# EAGLE design Geiger (EAGLE 5.11)
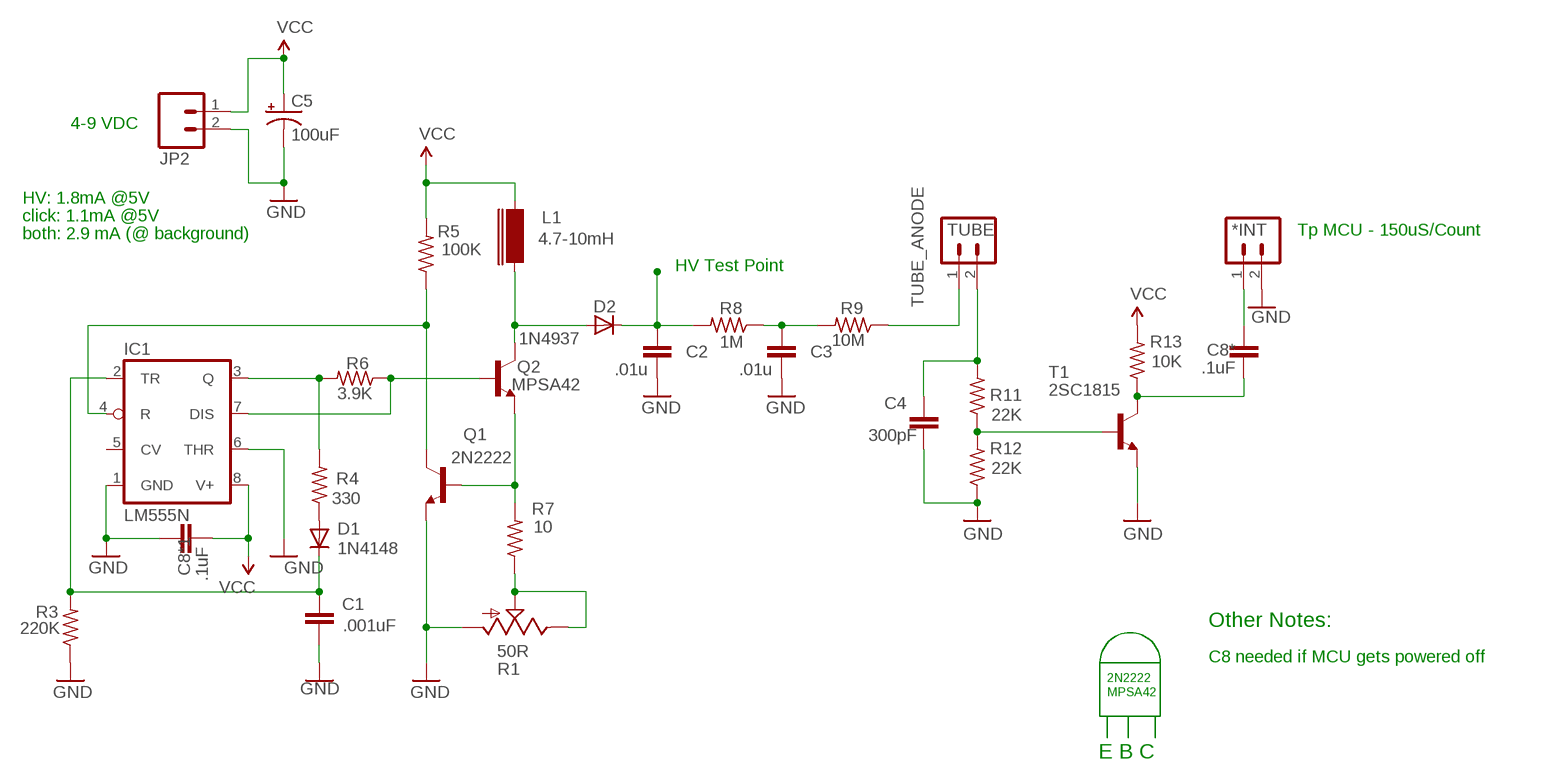
[diagram p0: schematic, sheet 1]

## Parts
*INT  M02PTH  [1X02]
C1  .001uF  CAPPTH  [CAP-PTH-SMALL]
C2  .01u  C-EU050-025X075  [C050-025X075]
C3  .01u  C-EU050-025X075  [C050-025X075]
C4  300pF  CAPPTH  [CAP-PTH-SMALL]
C5  100uF  CAP_POLPTH1  [CPOL-RADIAL-100UF-25V]
C8*  .1uF  CAPPTH  [CAP-PTH-SMALL]
C8*1  .1uF  CAPPTH  [CAP-PTH-SMALL]
D1  1N4148  1N4148DO35-7  [DO35-7]
D2  1N4937  1N4933  [DO41-10]
IC1  LM555N  [DIL08]
JP2  M02SCREW  [SCREWTERMINAL-3.5MM-2]
L1  4.7-10mH  INDUCTOR_4.7MH-1000  [.32IN_RADIAL]
Q1  2N2222  TRANSISTOR_NPNTO92  [TO-92]
Q2  MPSA42  TRANSISTOR_NPNTO92  [TO-92]
R1  50R  TRIM_US-B25P  [B25P]
R3  220K  R-US_0204/5  [0204/5]
R4  330  R-US_0204/5  [0204/5]
R5  100K  R-US_0204/5  [0204/5]
R6  3.9K  R-US_0204/5  [0204/5]
R7  10  R-US_0204/5  [0204/5]
R8  1M  R-US_0204/5  [0204/5]
R9  10M  R-US_0204/5  [0204/5]
R11  22K  R-US_0204/5  [0204/5]
R12  22K  R-US_0204/5  [0204/5]
R13  10K  R-US_0204/5  [0204/5]
T1  2SC1815  [TO92-ECB]
TUBE  M02PTH  [1X02]

## Nets
GND: *INT.2 C1.1 C2.2 C3.2 C4.1 C5.2(-) C8*1.1 IC1.1(GND) IC1.6(THR) JP2.2 Q1.1(E) R1.A R3.1 R12.1 T1.E
N$1: IC1.3(Q) R4.2 R6.2
N$2: C2.1 D2.C R8.2
N$3: R1.E R1.S R7.1
N$4: C1.2 D1.C IC1.2(TR) R3.2
N$5: C4.2 R11.2 TUBE.2
N$6: C3.1 R8.1 R9.2
N$8: R11.1 R12.2 T1.B
N$10: IC1.7(DIS) Q2.2(B) R6.1
N$12: IC1.4(R) Q1.3(C) R5.1
N$13: D1.A R4.1
N$14: C8*.2 R13.1 T1.C
N$15: Q1.2(B) Q2.1(E) R7.2
N$16: *INT.1 C8*.1
N$17: D2.A L1.2 Q2.3(C)
TUBE_ANODE: R9.1 TUBE.1
VCC: C5.1(+) C8*1.2 IC1.8(V+) JP2.1 L1.1 R5.2 R13.2
Unconnected: IC1.5(CV)

## Notes on the sheet
- 4-9 VDC
- HV: 1.8mA @5V
- click: 1.1mA @5V
- both: 2.9 mA (@ background) | Tp MCU - 150uS/Count
- HV Test Point
- Other Notes:
- C8 needed if MCU gets powered off
- 2N2222
- MPSA42
- E B C

## Library data of the parts
*INT JP2 TUBE = _JJG-parts:M02: Header 2 Standard 2-pin 0.1" header. Use with straight break away headers (SKU : PRT-00116), right angle break away headers (PRT-00553), swiss pins (PRT-00743), machine pins (PRT-00117), and female headers (PRT-00115). Molex polarized connector foot print use with SKU : PRT-08233 with associated crimp pins and housings.
C1 C4 C8* C8*1 = SparkFun:CAP: Capacitor Standard 0603 ceramic capacitor, and 0.1" leaded capacitor.
C2 C3 = resistor:C-EU: CAPACITOR, European symbol
C5 = SparkFun:CAP_POL: Capacitor Polarized These are standard SMD and PTH capacitors. Normally 10uF, 47uF, and 100uF in electrolytic and tantalum varieties. Always verify the external diameter of the through hole cap, it varies with capacity, voltage, and manufacturer. The EIA devices should be standard.
D1 = diode:1N4148: DIODE high speed (Philips)
D2 = diode:1N4933: DIODE fast recovery rectifier, 1A
IC1 = linear:*555: TIMER
L1 = _JJG-parts:INDUCTOR_4.7MH: INDUCTOR - .47 mH Goldmine #G16604
Q1 Q2 = SparkFun:TRANSISTOR_NPN: Transistor NPN BJT configuration in SOT23 package. MMBT2222 is the common NPN we use. Double check BCE configuration again layout.
R1 = pot:TRIM_US-: POTENTIOMETER
R3-R9 R11-R13 = rcl:R-US_: RESISTOR, American symbol
T1 = transistor:2SC1815: NPN EPITAXIAL TRANSISTOR Source: TOSHIBA .. 2SC1815 1.pdf

## Board
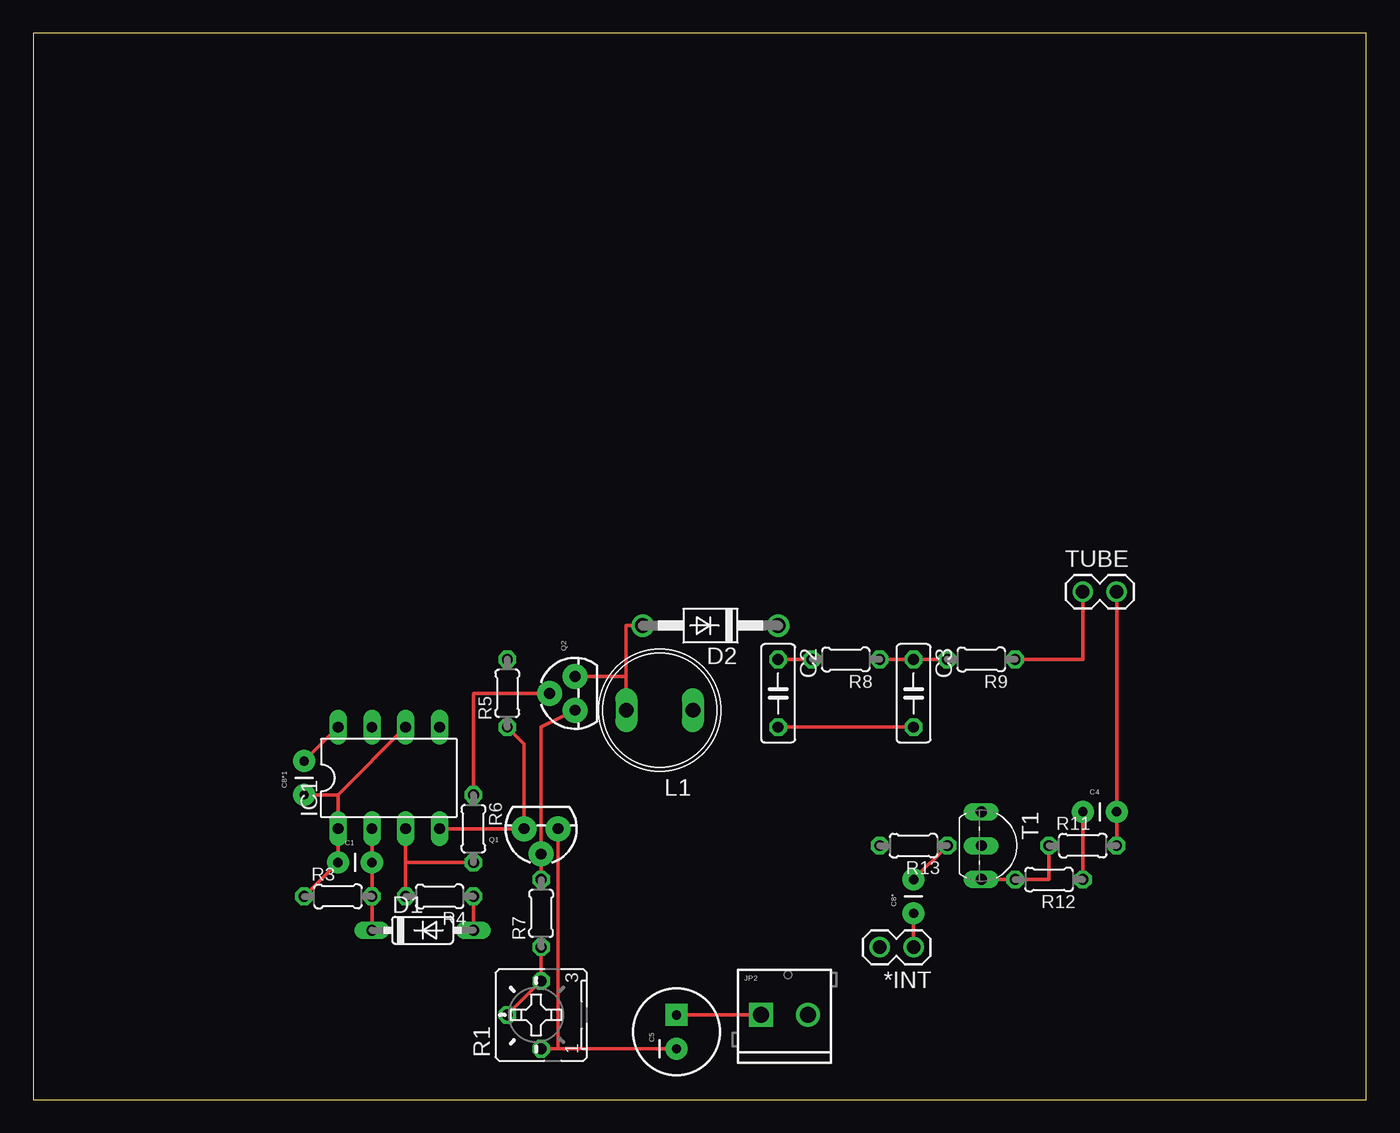
[diagram p1: board, top side]
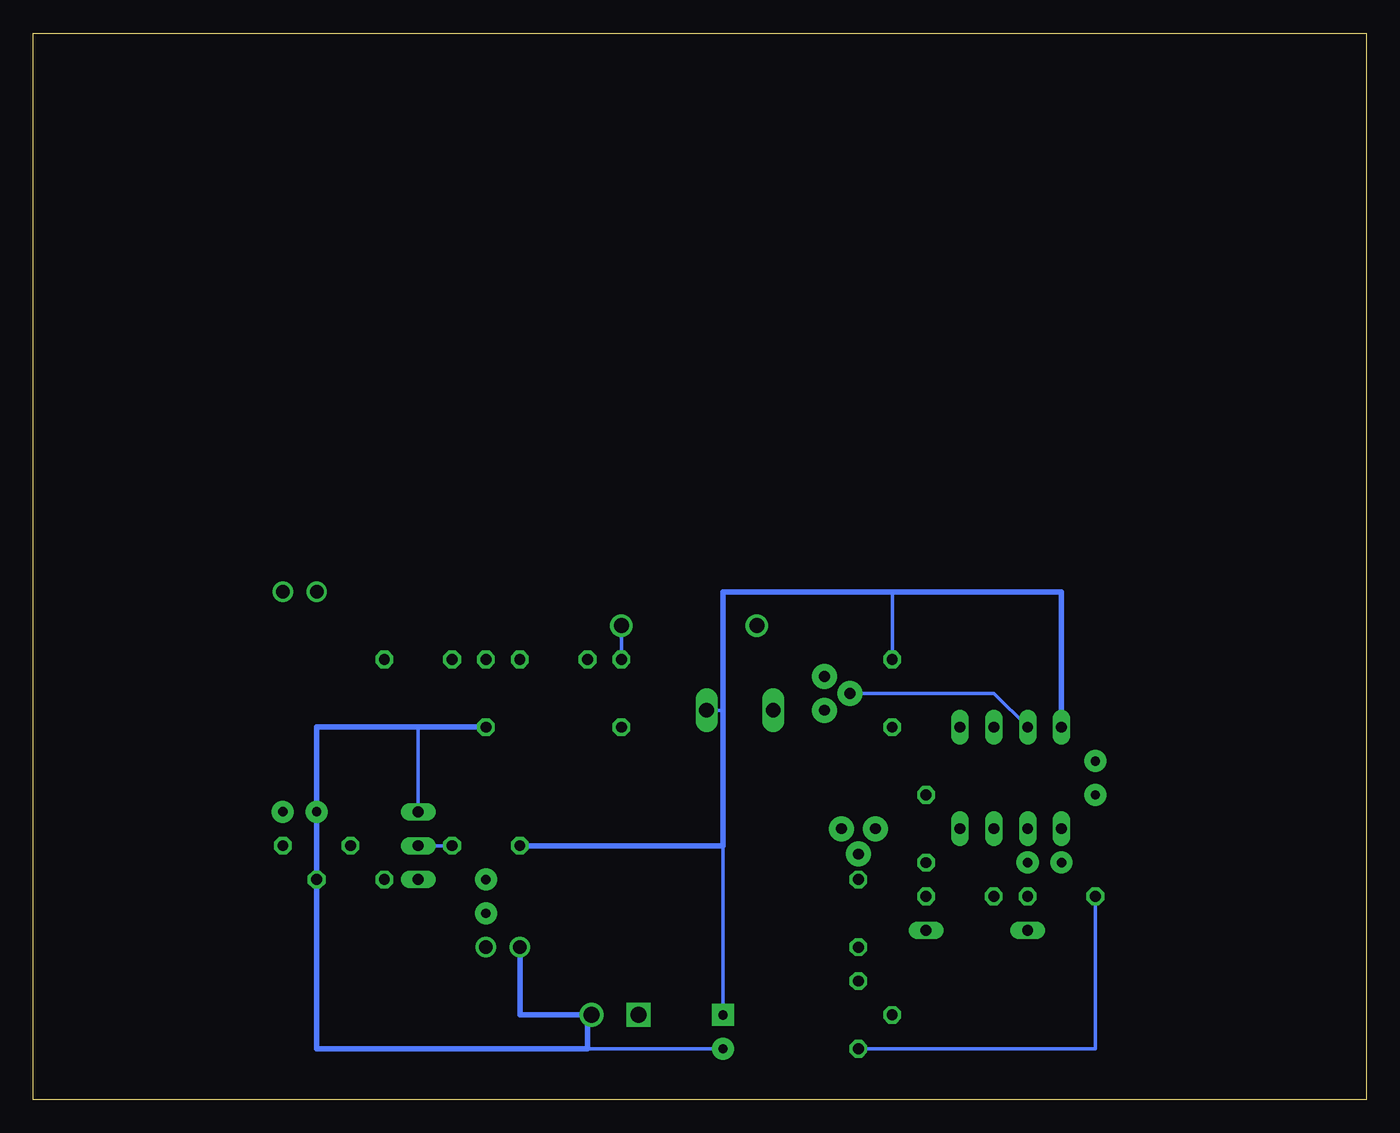
[diagram p2: board, bottom side, seen from below]

Size 100 x 80 mm. Coordinates in mm from the lower left corner, seen from the top.
Outline: 0,0 100,0 100,80 0,80 0,0
Copper layers (1*16): Top 0.035mm / dielectric 1.5mm / Bottom 0.035mm
Design rules "default": minimum track width 10mil, minimum drill 24mil, track to track 8mil, track to pad 8mil, pad to pad 8mil, via to via 8mil, smd to smd 8mil, copper to edge 40mil, drill to drill 8mil, minimum pad ring 10mil, minimum via ring 8mil, stop-mask expansion 4mil, vias tented up to drill 0mil, thermal gap 10mil

### Footprints (pad centres in the part's own frame; a part is rotated, then mirrored left to right if it is on the bottom)
1X02 = drill 1.016 round: 1 0,0; 2 2.54,0
CAP-PTH-SMALL = drill 0.7 pad 1.651 round: 1 0,0; 2 2.54,0
C050-025X075 = drill 0.813 octagon: 1 -2.54,0; 2 2.54,0
CPOL-RADIAL-100UF-25V = drill 0.7 pad 1.651 square: 1 1.27,0 | drill 0.7 pad 1.651 round: 2 -1.27,0
DO35-7 = drill 0.813 long: A 3.81,0; C -3.81,0
DO41-10 = drill 1.118 round: A 5.08,0; C -5.08,0
DIL08 = drill 0.813 long: 1 -3.81,-3.81; 2 -1.27,-3.81; 3 1.27,-3.81; 4 3.81,-3.81; 5 3.81,3.81; 6 1.27,3.81; 7 -1.27,3.81; 8 -3.81,3.81
SCREWTERMINAL-3.5MM-2 = drill 1.2 square: 1 0,0 | drill 1.2 round: 2 3.5,0
.32IN_RADIAL = drill 1.1 long: 1 -2.5,0; 2 2.5,0
TO-92 = drill 0.813 pad 1.88 round: 1 -1.27,0; 2 0,1.905; 3 1.27,0
B25P = drill 0.813 octagon: A -2.54,0; E 2.54,0; S 0,2.54
0204/5 = drill 0.813 octagon: 1 -2.54,0; 2 2.54,0
TO92-ECB = drill 0.813 long: B 2.54,0; C 0,0; E -2.54,0

### Placement (x,y rotation side)
*INT  66.04,11.43 180 top
C1  22.86,17.78 0 top
C2  55.88,30.48 270 top
C3  66.04,30.48 270 top
C4  78.74,21.59 0 top
C5  48.26,5.08 90 top
C8*  66.04,13.97 90 top
C8*1  20.32,22.86 90 top
D1  29.21,12.7 0 top
D2  50.8,35.56 180 top
IC1  26.67,24.13 0 top
JP2  54.61,6.35 0 top
L1  46.99,29.21 180 top
Q1  38.1,20.32 180 top
Q2  40.64,30.48 90 top
R1  38.1,6.35 90 top
R3  22.86,15.24 0 top
R4  30.48,15.24 180 top
R5  35.56,30.48 90 top
R6  33.02,20.32 270 top
R7  38.1,13.97 90 top
R8  60.96,33.02 180 top
R9  71.12,33.02 180 top
R11  78.74,19.05 0 top
R12  76.2,16.51 180 top
R13  66.04,19.05 180 top
T1  71.12,19.05 270 top
TUBE  78.74,38.1 0 top

### Tracks (layer width: path | path; a pad name or v marks a point on that pad's centre or on a via)
GND
  Top 0.254: 22.86,22.86 IC1.6 | 22.86,22.86 IC1.1 C1.1 R3.1 | C3.2 C2.2 | R12.1 C4.1 | 22.86,22.86 C8*1.1 | 39.37,3.81 C5.2 | R1.A 39.37,3.81 | 39.37,3.81 Q1.1
  Bottom 0.254: 58.42,6.35 JP2.2 | C5.2 58.42,3.81 | 71.12,27.94 T1.E | R3.1 20.32,3.81 R1.A
  Bottom 0.406: *INT.2 63.5,6.35 58.42,6.35 58.42,3.81 78.74,3.81 R12.1 C4.1 78.74,27.94 71.12,27.94 C3.2
N$1
  Top 0.254: 27.94,17.78 IC1.3 | R4.2 27.94,17.78 | 27.94,17.78 R6.2
N$2
  Top 0.254: C2.1 R8.2
  Bottom 0.254: C2.1 D2.C
N$3
  Top 0.254: R1.S R1.E R7.1
N$4
  Top 0.254: D1.C R3.2 C1.2 IC1.2
N$5
  Top 0.254: R11.2 C4.2 TUBE.2
N$6
  Top 0.254: R8.1 C3.1 R9.2
N$8
  Top 0.254: R11.1 76.2,16.51 R12.2 T1.B
N$10
  Top 0.254: R6.1 33.02,30.48 Q2.2
  Bottom 0.254: IC1.7 27.94,30.48 Q2.2
N$12
  Top 0.254: R5.1 36.83,26.67 Q1.3 IC1.4
N$13
  Top 0.254: D1.A R4.1
N$14
  Top 0.254: C8*.2 R13.1
  Bottom 0.254: R13.1 T1.C
N$15
  Top 0.254: R7.2 Q1.2 38.1,27.94 Q2.1
N$16
  Top 0.254: *INT.1 C8*.1
N$17
  Top 0.254: 44.45,31.75 Q2.3 | 44.45,31.75 44.45,35.56 D2.A | L1.2 44.45,31.75
TUBE_ANODE
  Top 0.254: R9.1 78.74,33.02 TUBE.1
VCC
  Top 0.254: C5.1 JP2.1 | C8*1.2 IC1.8
  Bottom 0.254: 35.56,38.1 R5.2 | 48.26,29.21 L1.1 | 48.26,19.05 C5.1
  Bottom 0.406: R13.2 48.26,19.05 48.26,29.21 48.26,38.1 35.56,38.1 22.86,38.1 IC1.8